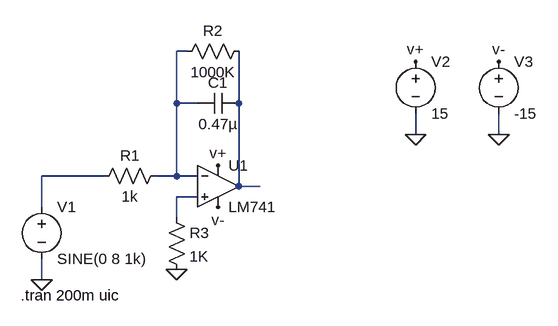
[diagram p0: schematic integrador final.asc]
integrador final.asc, the LTspice schematic file:
Version 4
SHEET 1 880 680
WIRE 144 -96 128 -96
WIRE 128 -16 128 -96
WIRE 160 -16 128 -16
WIRE 224 -16 224 -96
WIRE 496 32 496 0
WIRE 624 32 624 0
WIRE 16 96 -80 96
WIRE 128 96 128 -16
WIRE 128 96 96 96
WIRE 160 96 128 96
WIRE 224 112 224 -16
WIRE 256 112 224 112
WIRE 160 128 128 128
WIRE -80 144 -80 96
WIRE 128 160 128 128
WIRE -80 256 -80 224
FLAG -80 256 0
FLAG 496 32 0
FLAG 624 32 0
FLAG 496 -80 v+
FLAG 192 80 v+
FLAG 624 -80 v-
FLAG 192 144 v-
FLAG 128 240 0
SYMBOL res 112 80 R90
WINDOW 0 0 56 VBottom 2
WINDOW 3 32 56 VTop 2
SYMATTR InstName R1
SYMATTR Value 1k
SYMBOL cap 224 -32 R90
WINDOW 0 0 32 VBottom 2
WINDOW 3 32 32 VTop 2
SYMATTR InstName C1
SYMATTR Value 0.47µ
SYMBOL res 240 -112 R90
WINDOW 0 0 56 VBottom 2
WINDOW 3 32 56 VTop 2
SYMATTR InstName R2
SYMATTR Value 1000K
SYMBOL voltage -80 128 R0
WINDOW 123 0 0 Left 0
WINDOW 39 0 0 Left 0
SYMATTR InstName V1
SYMATTR Value SINE(0 8 1k)
SYMBOL voltage 496 -96 R0
WINDOW 123 0 0 Left 0
WINDOW 39 0 0 Left 0
SYMATTR InstName V2
SYMATTR Value 15
SYMBOL voltage 624 -96 R0
WINDOW 123 0 0 Left 0
WINDOW 39 0 0 Left 0
SYMATTR InstName V3
SYMATTR Value -15
SYMBOL res 112 144 R0
SYMATTR InstName R3
SYMATTR Value 1K
SYMBOL LM741 192 48 R0
SYMATTR InstName U1
TEXT -112 280 Left 2 !.tran 200m uic

The netlist it stands for:
* integrador final.asc
R1 N001 N003 1k
C1 N002 N001 0.47µ
R2 N002 N001 1000K
V1 N003 0 SINE(0 8 1k)
V2 v+ 0 15
V3 v- 0 -15
R3 N004 0 1K
XU1 N004 N001 v+ v- N002 LM741  ; pins In+ In- V+ V- OUT
.tran 200m uic
.lib LM741.lib
.backanno
.end